# Altium schematic sheet BaseCircuit_DT.SchDoc
size A
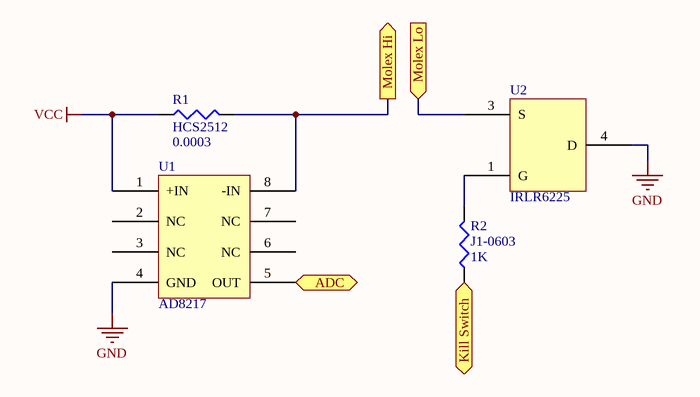
[diagram p0: BaseCircuit_DT.SchDoc]

## Parts
R1  HCS2512  value 0.0003  [HCS2512FTL300CT-ND_DT]
R2  J1-0603  value 1K  [J1-0603]
U1  AD8217  [AD8217_DT]
U2  IRLR6225  [IRLR6225_DT]

## Ports
ADC (out), Kill Switch (in), Molex Hi (out), Molex Lo (in)

## Nets
GND: U1.4(GND) U2.4(D)
VCC: R1.1 U1.1(+IN)
ADC: U1.5(OUT) ; port ADC
Kill Switch: R2.1 ; port Kill Switch
Molex Hi: R1.2 U1.8(-IN) ; port Molex Hi
Molex Lo: U2.3(S) ; port Molex Lo
NetR2_2: R2.2 U2.1(G)

Not connected (* = marked no-connect by the designer): U1 2(NC) 3(NC) 6(NC) 7(NC)

## Library data of the parts
R1 R2 = Res3: Resistor; Published: 8-Jun-2000; LatestRevisionDate: 29-May-2009; LatestRevisionNote: IPC-7351 Footprint Added.; PackageReference: J1-0603; Publisher: Altium Limited; PackageDescription: Chip Resistor
U1 U2 = Component_1